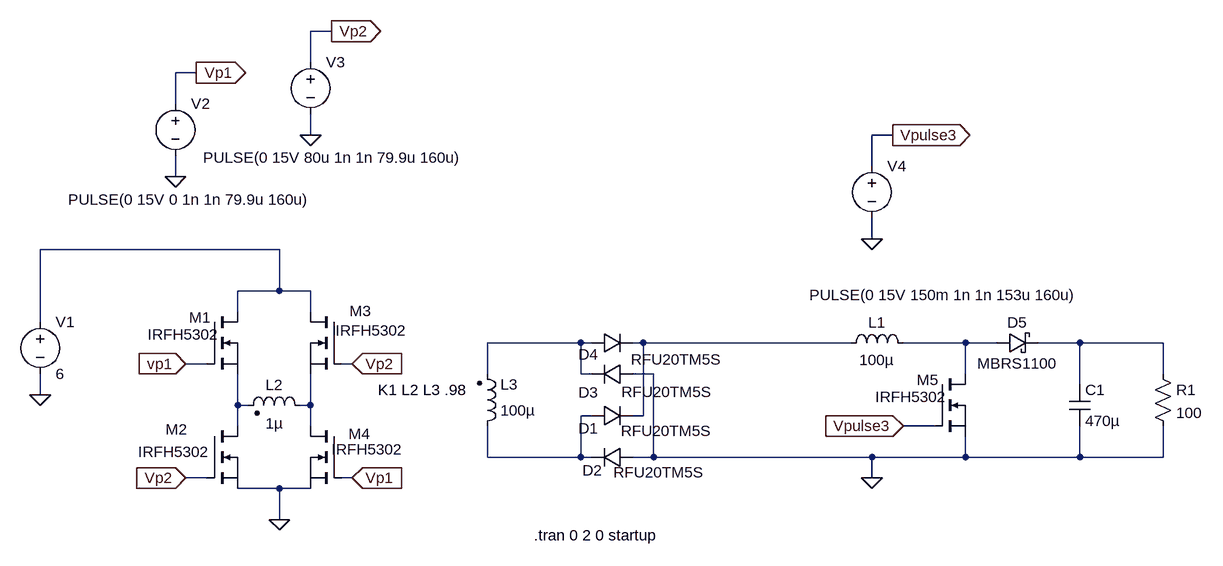
[diagram p0: schematic fullbridge.asc]
fullbridge.asc, the LTspice schematic file:
Version 4
SHEET 1 1752 680
WIRE -256 -544 -288 -544
WIRE -288 -496 -288 -544
WIRE -464 -480 -496 -480
WIRE -496 -432 -496 -480
WIRE -288 -384 -288 -416
WIRE 608 -384 576 -384
WIRE 576 -336 576 -384
WIRE -496 -320 -496 -352
WIRE 576 -224 576 -256
WIRE -336 -208 -704 -208
WIRE -336 -144 -336 -208
WIRE -336 -144 -400 -144
WIRE -288 -144 -336 -144
WIRE -400 -112 -400 -144
WIRE -288 -112 -288 -144
WIRE -704 -96 -704 -208
WIRE 128 -64 -16 -64
WIRE 144 -64 128 -64
WIRE 224 -64 208 -64
WIRE 544 -64 224 -64
WIRE 720 -64 624 -64
WIRE 768 -64 720 -64
WIRE 896 -64 832 -64
WIRE 1024 -64 896 -64
WIRE -448 -32 -480 -32
WIRE -224 -32 -240 -32
WIRE -16 -16 -16 -64
WIRE 128 -16 128 -64
WIRE 144 -16 128 -16
WIRE 240 -16 208 -16
WIRE 720 -16 720 -64
WIRE 1024 -16 1024 -64
WIRE 896 0 896 -64
WIRE -704 16 -704 -16
WIRE -400 32 -400 -16
WIRE -384 32 -400 32
WIRE -288 32 -288 -16
WIRE -288 32 -304 32
WIRE 144 48 128 48
WIRE 224 48 224 -64
WIRE 224 48 208 48
WIRE -400 64 -400 32
WIRE -288 64 -288 32
WIRE 672 64 624 64
WIRE -16 112 -16 64
WIRE 128 112 128 48
WIRE 128 112 -16 112
WIRE 144 112 128 112
WIRE 240 112 240 -16
WIRE 240 112 208 112
WIRE 576 112 240 112
WIRE 720 112 720 80
WIRE 720 112 576 112
WIRE 896 112 896 64
WIRE 896 112 720 112
WIRE 1024 112 1024 64
WIRE 1024 112 896 112
WIRE -448 144 -480 144
WIRE -224 144 -240 144
WIRE 576 144 576 112
WIRE -336 160 -400 160
WIRE -288 160 -336 160
WIRE -336 208 -336 160
FLAG -336 208 0
FLAG -496 -320 0
FLAG -464 -480 Vp1
IOPIN -464 -480 Out
FLAG -288 -384 0
FLAG -256 -544 Vp2
IOPIN -256 -544 Out
FLAG -480 -32 vp1
IOPIN -480 -32 In
FLAG -224 144 Vp1
IOPIN -224 144 In
FLAG -224 -32 Vp2
IOPIN -224 -32 In
FLAG -480 144 Vp2
IOPIN -480 144 In
FLAG 576 -224 0
FLAG 624 64 Vpulse3
IOPIN 624 64 In
FLAG 608 -384 Vpulse3
IOPIN 608 -384 Out
FLAG -704 16 0
FLAG 576 144 0
SYMBOL nmos -448 -112 R0
WINDOW 0 -27 9 Left 2
WINDOW 3 -91 35 Left 2
SYMATTR InstName M1
SYMATTR Value IRFH5302
SYMBOL ind 528 -48 R270
WINDOW 0 32 56 VTop 2
WINDOW 3 5 56 VBottom 2
SYMATTR InstName L1
SYMATTR Value 100µ
SYMBOL voltage -496 -448 R0
WINDOW 123 0 0 Left 2
WINDOW 39 0 0 Left 2
WINDOW 3 -165 163 Left 2
SYMATTR Value PULSE(0 15V 0 1n 1n 79.9u 160u)
SYMATTR InstName V2
SYMBOL ind2 -288 48 M270
WINDOW 0 32 56 VTop 2
WINDOW 3 4 56 VBottom 2
SYMATTR InstName L2
SYMATTR Value 1µ
SYMATTR Type ind
SYMBOL ind2 -32 80 M180
WINDOW 0 36 80 Left 2
WINDOW 3 36 40 Left 2
SYMATTR InstName L3
SYMATTR Value 100µ
SYMATTR Type ind
SYMBOL voltage -288 -512 R0
WINDOW 123 0 0 Left 2
WINDOW 39 0 0 Left 2
WINDOW 3 -165 163 Left 2
SYMATTR Value PULSE(0 15V 80u 1n 1n 79.9u 160u)
SYMATTR InstName V3
SYMBOL nmos -448 64 R0
WINDOW 0 -63 5 Left 2
WINDOW 3 -105 40 Left 2
SYMATTR InstName M2
SYMATTR Value IRFH5302
SYMBOL nmos -240 -112 M0
WINDOW 0 -46 -1 Left 2
WINDOW 3 -101 29 Left 2
SYMATTR InstName M3
SYMATTR Value IRFH5302
SYMBOL nmos -240 64 M0
WINDOW 0 -44 12 Left 2
WINDOW 3 -95 36 Left 2
SYMATTR InstName M4
SYMATTR Value IRFH5302
SYMBOL cap 880 0 R0
SYMATTR InstName C1
SYMATTR Value 470µ
SYMBOL res 1008 -32 R0
SYMATTR InstName R1
SYMATTR Value 100
SYMBOL voltage 576 -352 R0
WINDOW 123 0 0 Left 2
WINDOW 39 0 0 Left 2
WINDOW 3 -96 214 Left 2
SYMATTR Value PULSE(0 15V 150m 1n 1n 153u 160u)
SYMATTR InstName V4
SYMBOL nmos 672 -16 R0
WINDOW 0 -27 9 Left 2
WINDOW 3 -91 35 Left 2
SYMATTR InstName M5
SYMATTR Value IRFH5302
SYMBOL schottky 768 -48 R270
WINDOW 0 32 32 VTop 2
WINDOW 3 0 32 VBottom 2
SYMATTR InstName D5
SYMATTR Value MBRS1100
SYMBOL voltage -704 -112 R0
WINDOW 123 0 0 Left 2
WINDOW 39 0 0 Left 2
SYMATTR InstName V1
SYMATTR Value 6
SYMBOL diode 144 64 R270
WINDOW 0 -19 -4 VTop 2
WINDOW 3 8 116 VBottom 2
SYMATTR InstName D1
SYMATTR Value RFU20TM5S
SYMBOL diode 208 96 R90
WINDOW 0 52 62 VBottom 2
WINDOW 3 24 -41 VTop 2
SYMATTR InstName D2
SYMATTR Value RFU20TM5S
SYMBOL diode 208 -32 R90
WINDOW 0 60 68 VBottom 2
WINDOW 3 28 -53 VTop 2
SYMATTR InstName D3
SYMATTR Value RFU20TM5S
SYMBOL diode 144 -48 R270
WINDOW 0 -17 -4 VTop 2
WINDOW 3 6 132 VBottom 2
SYMATTR InstName D4
SYMATTR Value RFU20TM5S
TEXT 56 232 Left 2 !.tran 0 2 0 startup
TEXT -184 8 Left 2 !K1 L2 L3 .98

The netlist it stands for:
* fullbridge.asc
M1 N001 Vp1 N006 N006 IRFH5302
L1 N003 N004 100µ
V2 Vp1 0 PULSE(0 15V 0 1n 1n 79.9u 160u)
L2 N007 N006 1µ
L3 N008 N002 100µ
V3 Vp2 0 PULSE(0 15V 80u 1n 1n 79.9u 160u)
M2 N006 Vp2 0 0 IRFH5302
M3 N001 Vp2 N007 N007 IRFH5302
M4 N007 Vp1 0 0 IRFH5302
C1 N005 0 470µ
R1 N005 0 100
V4 Vpulse3 0 PULSE(0 15V 150m 1n 1n 153u 160u)
M5 N004 Vpulse3 0 0 IRFH5302
D5 N004 N005 MBRS1100
V1 N001 0 6
D1 N008 N003 RFU20TM5S
D2 0 N008 RFU20TM5S
D3 0 N002 RFU20TM5S
D4 N002 N003 RFU20TM5S
.model D D
.lib standard.dio
.model NMOS NMOS
.model PMOS PMOS
.lib standard.mos
.tran 0 2 0 startup
K1 L2 L3 .98
.backanno
.end